# EAGLE design SP_Inverter_SW (EAGLE 9.6.2)
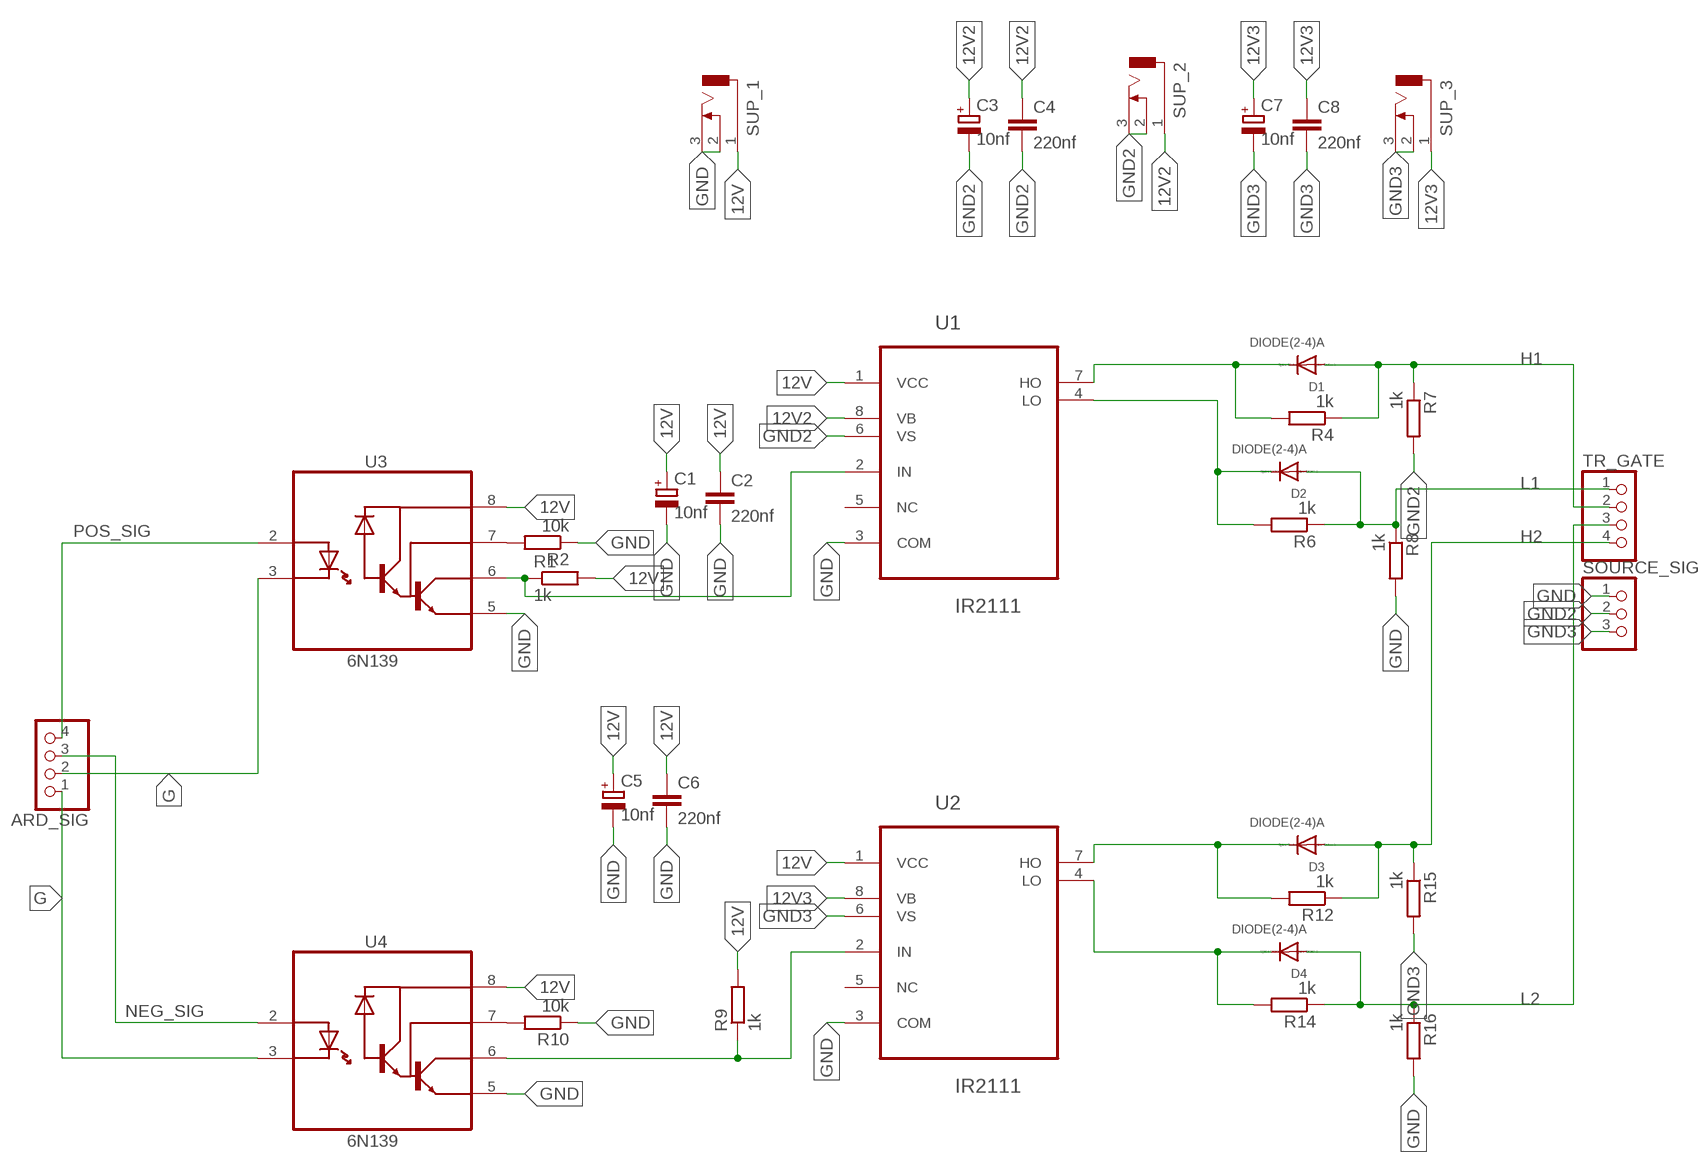
[diagram p0: schematic, sheet 1]

## Parts
ARD_SIG  PINHD-1X4  [1X04]
C1  10nf  CAP_POL  [E3,5-8]
C2  220nf  CAPACITOR  [C025-025X050]
C3  10nf  CAP_POL  [E3,5-8]
C4  220nf  CAPACITOR  [C025-025X050]
C5  10nf  CAP_POL  [E3,5-8]
C6  220nf  CAPACITOR  [C025-025X050]
C7  10nf  CAP_POL  [E3,5-8]
C8  220nf  CAPACITOR  [C025-025X050]
D1  DIODE(2-4)A  [DO35-10]
D2  DIODE(2-4)A  [DO35-10]
D3  DIODE(2-4)A  [DO35-10]
D4  DIODE(2-4)A  [DO35-10]
R1  1k  R-EU_0204/7  [0204/7]
R2  10k  R-EU_0204/7  [0204/7]
R4  1k  R-EU_0204/7  [0204/7]
R6  1k  R-EU_0204/7  [0204/7]
R7  1k  R-EU_0204/7  [0204/7]
R8  1k  R-EU_0204/7  [0204/7]
R9  1k  R-EU_0204/7  [0204/7]
R10  10k  R-EU_0204/7  [0204/7]
R12  1k  R-EU_0204/7  [0204/7]
R14  1k  R-EU_0204/7  [0204/7]
R15  1k  R-EU_0204/7  [0204/7]
R16  1k  R-EU_0204/7  [0204/7]
SOURCE_SIG  source_Sig  PINHD-1X3  [1X03]
SUP_1  CON_JACK  [DCJ0303]
SUP_2  CON_JACK  [DCJ0303]
SUP_3  CON_JACK  [DCJ0303]
TR_GATE  PINHD-1X4  [1X04]
U1  IR2111  [DIP254P762X533-8]
U2  IR2111  [DIP254P762X533-8]
U3  6N139  [DIP762W50P254L977H451Q8]
U4  6N139  [DIP762W50P254L977H451Q8]

## Nets
12V: C1.+ C2.1 C5.+ C6.1 R1.2 R9.2 SUP_1.1 U1.1(VCC) U2.1(VCC) U3.8(VCC) U4.8(VCC)
12V2: C3.+ C4.1 SUP_2.1 U1.8(VB)
12V3: C7.+ C8.1 SUP_3.1 U2.8(VB)
G: ARD_SIG.1 ARD_SIG.2 U3.3(C) U4.3(C)
GND: C1.- C2.2 C5.- C6.2 R2.1 R8.2 R10.1 R16.2 SOURCE_SIG.1 SUP_1.2 SUP_1.3 U1.3(COM) U2.3(COM) U3.5(GND) U4.5(GND)
GND2: C3.- C4.2 R7.2 SOURCE_SIG.2 SUP_2.2 SUP_2.3 U1.6(VS)
GND3: C7.- C8.2 R15.2 SOURCE_SIG.3 SUP_3.2 SUP_3.3 U2.6(VS)
H1: D1.A R4.1 R7.1 TR_GATE.2
H2: D3.A R12.1 R15.1 TR_GATE.4
L1: D2.A R6.1 R8.1 TR_GATE.1
L2: D4.A R14.1 R16.1 TR_GATE.3
N$2: D1.C R4.2 U1.7(HO)
N$3: D2.C R6.2 U1.4(LO)
N$5: R9.1 U2.2(IN) U4.6(VO)
N$8: D3.C R12.2 U2.7(HO)
N$9: R2.2 U3.7(VB)
N$11: R1.1 U1.2(IN) U3.6(VO)
N$14: R10.2 U4.7(VB)
N$20: D4.C R14.2 U2.4(LO)
NEG_SIG: ARD_SIG.3 U4.2(A)
POS_SIG: ARD_SIG.4 U3.2(A)
Unconnected: U1.5(NC) U2.5(NC)

## Library data of the parts
ARD_SIG TR_GATE = pinhead:PINHD-1X4: PIN HEADER
C1 C3 C5 C7 = MIA_LIBRARY-2-2-2:CAP_POL
C2 C4 C6 C8 = MIA_LIBRARY-2-2-2:CAPACITOR
D1-D4 = MIA_LIBRARY-2-2-2:DIODE(2-4)A: DIODE high speed (Philips)
R1 R2 R4 R6-R10 R12 R14-R16 = rcl:R-EU_: RESISTOR, European symbol; SPICEPREFIX: R
SOURCE_SIG = MIA_LIBRARY-2-2-2:PINHD-1X3: PIN HEADER
SUP_1-SUP_3 = MIA_LIBRARY-2-2-2:CON_JACK: DC POWER JACK Source: DCJ0303.pdf; OC_FARNELL: unknown; OC_NEWARK: unknown
U1 U2 = MIA_LIBRARY-2-2-2:IR2111: HALF BRIDGE DRIVER Check prices <https://pricing.snapeda.com/parts/IR2111/Infineon/view-part?ref=eda>; AVAILABILITY: In Stock; DESCRIPTION: Half-Bridge Gate Driver IC Non-Inverting 8-PDIP; MF: Infineon; MP: IR2111; PACKAGE: DIP-8 International Rectifier; PRICE: None; PURCHASE-URL: https://pricing.snapeda.com/search/part/IR2111/?ref=eda
U3 U4 = MIA_LIBRARY-2-2-2:6N139: High Speed Optocoupler, 100 kBd, Low Input Current, Photodiode Darlington Output Check prices <https://pricing.snapeda.com/parts/6N139/Vishay%20Semiconductor/view-part?ref=eda>; AVAILABILITY: In Stock; DESCRIPTION: Optoisolator Darlington with Base Output 5300Vrms 1 Channel 8-DIP; MF: Vishay Semiconductor; MP: 6N139; PACKAGE: DIP-8 Everlight; PRICE: None; PURCHASE-URL: https://pricing.snapeda.com/search/part/6N139/?ref=eda

## Board
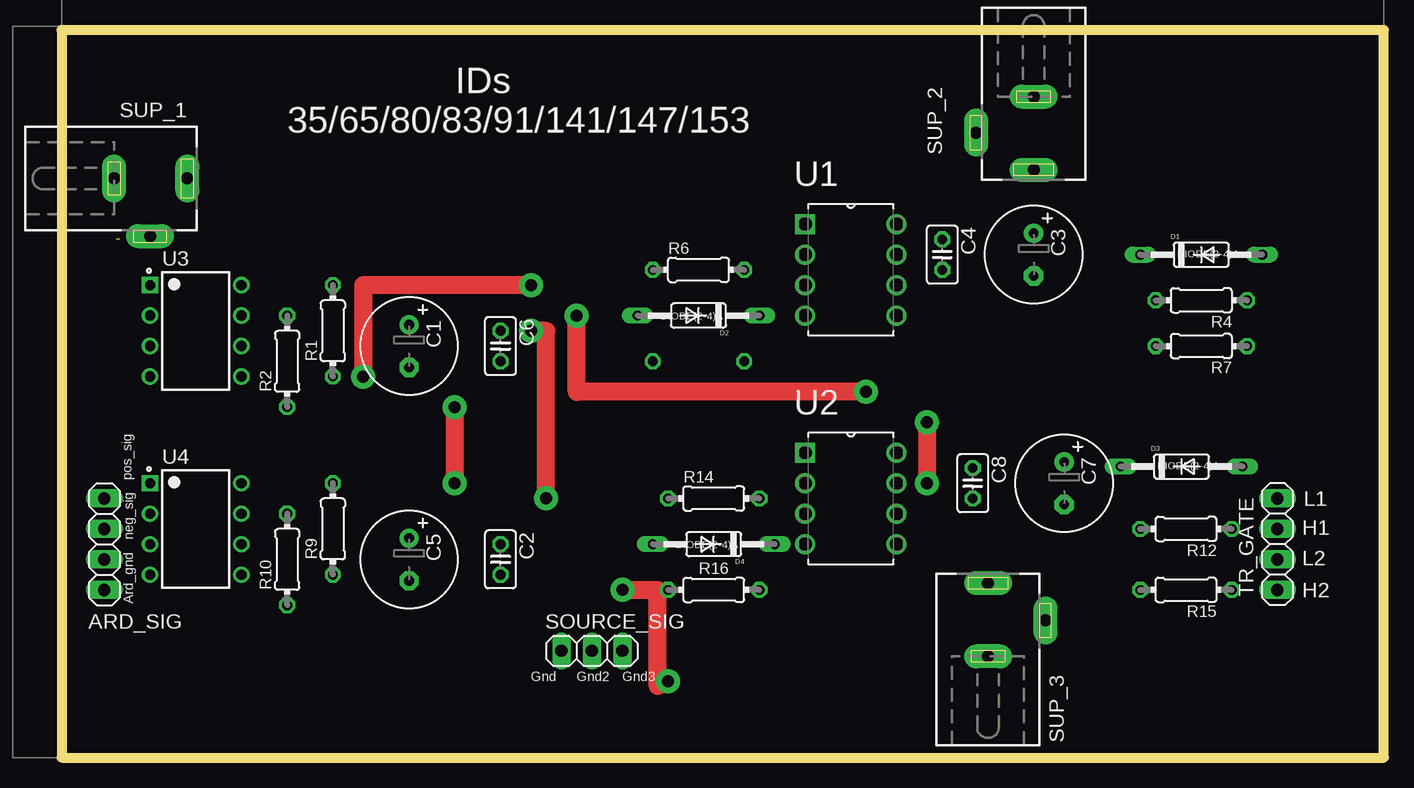
[diagram p1: board, top side]
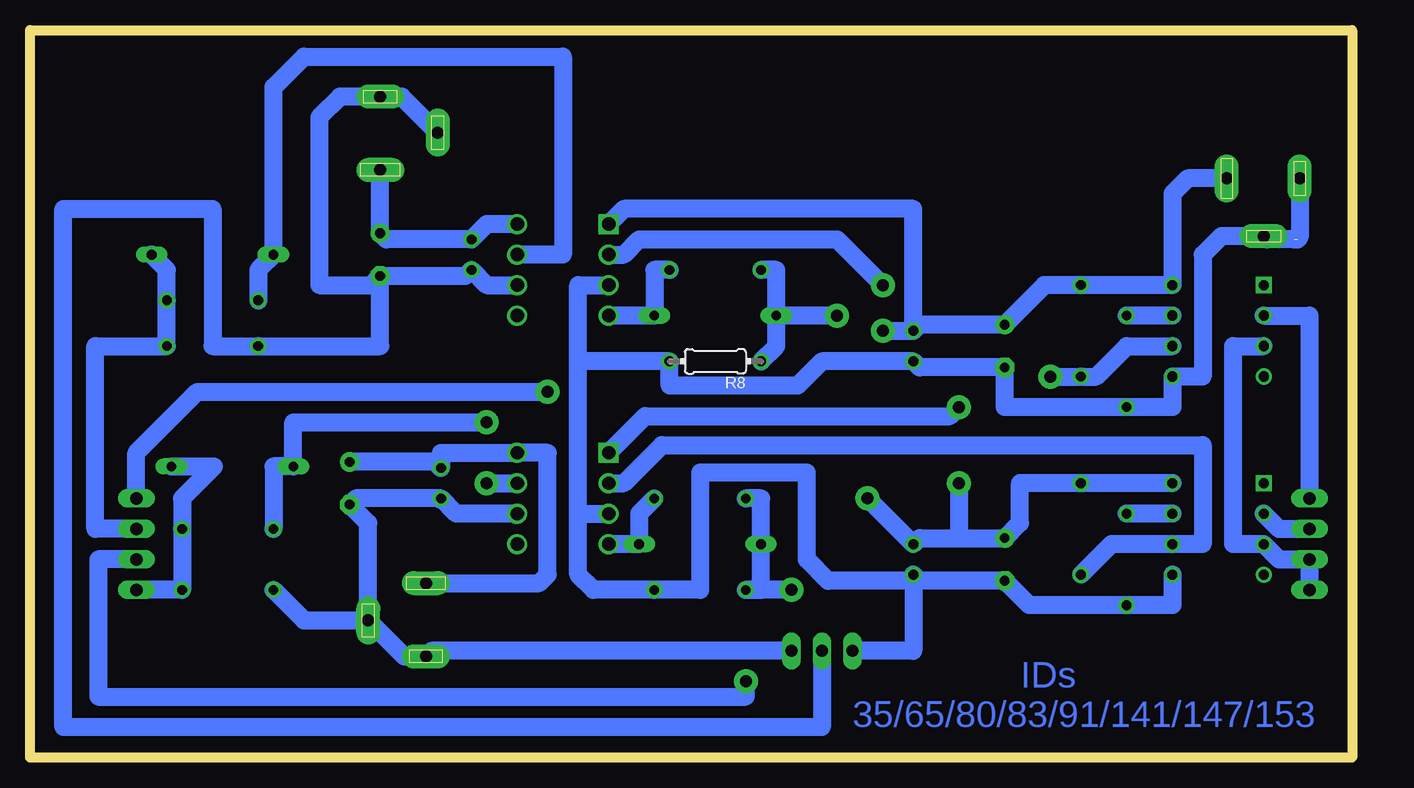
[diagram p2: board, bottom side, seen from below]

Size 110.22 x 60.63 mm. Coordinates in mm from the lower left corner, seen from the top.
Outline: 0,0 110.22,0 110.22,60.63 0,60.63 0,0
Copper layers (1*16): Top 0.035mm / dielectric 1.5mm / Bottom 0.035mm
Design rules "default": minimum track width 6mil, minimum drill 0.35mm, track to track 6mil, track to pad 6mil, pad to pad 6mil, via to via 6mil, smd to smd 6mil, copper to edge 40mil, drill to drill 6mil, minimum pad ring 10mil, minimum via ring 8mil, stop-mask expansion 4mil, vias tented up to drill 0mil, thermal gap 10mil

### Footprints (pad centres in the part's own frame; a part is rotated, then mirrored left to right if it is on the bottom)
1X04 = drill 1.016 long: 1 -3.81,0; 2 -1.27,0; 3 1.27,0; 4 3.81,0
E3,5-8 = drill 0.813 pad 1.6: + -1.778,0 | drill 0.813 pad 1.6 octagon: - 1.778,0
C025-025X050 = drill 0.813 octagon: 1 -1.27,0; 2 1.27,0
DO35-10 = drill 0.813 long: A 5.08,0; C -5.08,0
0204/7 = drill 0.813 octagon: 1 -3.81,0; 2 3.81,0
1X03 = drill 1.016 long: 1 -2.54,0; 2 0,0; 3 2.54,0
DCJ0303 = drill 1 pad 2 long: 1 0,3.1; 2 4.8,0; 3 0,-3
DIP254P762X533-8 = drill 1.118 square: 1 -7.62,7.62 | drill 1.118: 2 -7.62,5.08; 3 -7.62,2.54; 4 -7.62,0; 5 0,0; 6 0,2.54; 7 0,5.08; 8 0,7.62
DIP762W50P254L977H451Q8 = drill 0.85 pad 1.35 square: 1 -3.81,3.81 | drill 0.85 pad 1.35: 2 -3.81,1.27; 3 -3.81,-1.27; 4 -3.81,-3.81; 5 3.81,-3.81; 6 3.81,-1.27; 7 3.81,1.27; 8 3.81,3.81

### Placement (x,y rotation side)
ARD_SIG  3.56,17.78 90 top
C1  28.96,34.29 270 top
C2  36.58,16.51 270 top
C3  81.03,41.91 270 top
C4  73.41,41.91 270 top
C5  28.96,16.51 270 top
C6  36.58,34.29 270 top
C7  83.57,22.86 270 top
C8  75.95,22.86 270 top
D1  95,41.91 0 top
D2  53.09,36.83 180 top
D3  93.34,24.26 0 top
D4  54.36,17.78 180 top
R1  22.61,35.56 90 top
R2  18.8,33.02 90 top
R4  95,38.1 180 top
R6  53.09,40.64 0 top
R7  95,34.29 180 top
R8  53.09,33.02 180 bottom
R9  22.61,19.05 90 top
R10  18.8,16.51 90 top
R12  93.73,19.05 180 top
R14  54.36,21.59 0 top
R15  93.73,13.97 180 top
R16  54.36,13.97 0 top
SOURCE_SIG  44.2,8.89 0 top
SUP_1  7.37,48.26 270 top
SUP_2  81.03,52.07 180 top
SUP_3  77.22,11.43 0 top
TR_GATE  101.35,17.78 270 top
U1  69.6,36.83 0 top
U2  69.6,17.78 0 top
U3  11.18,35.56 0 top
U4  11.18,19.05 0 top

### Tracks (layer width: path | path; a pad name or v marks a point on that pad's centre or on a via)
12V  (via drill 1 pad 2)
  Top 1.5: v40.39,21.59 40.39,35.56 v39.12,35.56 | v32.77,29.21 v32.77,22.86
  Bottom 1.5: SUP_1.1 13.72,48.26 14.99,46.99 U3.8 R1.2 25.65,39.37 C1.+ 36.07,36.07 C6.1 | C6.1 36.58,45.72 60.71,45.72 U1.1 | U4.8 R9.2 27.69,22.86 27.69,19.56 C5.+ 32.77,18.29 | 32.77,18.29 36.07,18.29 C2.1 v40.39,21.59 | v39.12,35.56 C6.1 | U2.1 58.93,28.45 33.53,28.45 v32.77,29.21 | v32.77,22.86 32.77,18.29
12V2
  Bottom 1.5: SUP_2.1 C3.+ 80.52,43.18 C4.1 72.14,44.45 U1.8
12V3
  Bottom 1.5: C7.+ 76.45,24.64 C8.1 75.95,25.4 U2.8 67.06,25.4 67.06,15.24 67.77,14.53 SUP_3.1
G
  Bottom 1.5: ARD_SIG.1 ARD_SIG.2 6.1,16.51 U4.3 9.91,17.78 9.91,34.29 U3.3
GND  (1 unrouted)
  Bottom 1.5: SUP_1.3 4.37,43.36 4.55,43.18 | 4.83,43.18 7.09,43.18 SUP_1.2 10.9,43.46 12.45,41.91 12.45,31.75 U3.5 14.99,29.21 R2.1 28.96,29.21 C1.- 36.07,32.51 C6.2 44.2,33.02 46.23,30.99 56.9,30.99 R8.2 64.52,33.02 | 64.52,33.02 64.52,39.37 U1.3 | U4.5 14.99,12.7 R10.1 26.92,12.7 C5.- 36.07,14.73 | 36.07,14.73 C2.2 36.58,8.89 SOURCE_SIG.1 | 64.52,20.32 64.52,15.24 63.25,13.97 R16.2 54.36,13.97 54.36,23.75 45.47,23.75 45.47,16.51 43.69,14.73 36.07,14.73 | 64.52,20.32 U2.3 | 64.52,20.32 64.52,33.02
GND2
  Bottom 1.5: C3.- 81.03,34.29 R7.2 95,34.29 95,45.72 107.44,45.72 107.44,2.54 44.2,2.54 SOURCE_SIG.2 | SUP_2.2 79.23,55.07 SUP_2.3 84.38,55.07 86.11,53.34 86.11,39.37 81.79,39.37 C3.- | C3.- 73.91,40.13 C4.2 72.14,39.37 U1.6
GND3
  Bottom 1.5: SOURCE_SIG.3 76.76,8.89 SUP_3.3 79.02,8.43 SUP_3.2 | SUP_3.2 82.02,19.53 C7.- 83.06,21.59 C8.2 | 69.72,20.19 U2.6 74.68,20.32 C8.2 | C8.2 75.95,21.46 | R15.2 87.38,11.43 SUP_3.2
H1
  Bottom 1.5: D1.A 98.81,40.64 R4.1 R7.1 104.77,34.29 104.77,19.05 TR_GATE.2
H2
  Bottom 1.5: D3.A 94.87,24.26 97.54,21.59 R12.1 R15.1 TR_GATE.4
L1  (via drill 1 pad 2)
  Top 1.5: v67.06,30.48 42.93,30.48 v42.93,36.83
  Bottom 1.5: R8.1 48.01,34.29 D2.A | D2.A 48.01,40.64 R6.1 | TR_GATE.1 101.35,25.4 96.27,30.48 v67.06,30.48 | v42.93,36.83 D2.A
L2  (via drill 1 pad 2)
  Top 1.5: v50.55,6.35 50.07,6.35 49.67,5.96 49.67,13.97 v46.74,13.97
  Bottom 1.5: R14.1 49.28,21.59 D4.A 49.28,13.97 R16.1 v46.74,13.97 | TR_GATE.3 104.52,16.51 104.52,5.08 50.55,5.08 v50.55,6.35
N$2
  Bottom 1.5: R4.2 91.19,40.64 D1.C 89.92,55.88 87.38,58.42 65.79,58.42 65.79,41.91 U1.7
N$3
  Bottom 1.5: R6.2 58.17,40.64 D2.C U1.4
N$5
  Bottom 1.5: R9.1 20.07,17.78 U4.6 12.45,17.78 12.45,26.04 57.53,26.04 60.71,22.86 U2.2
N$8  (via drill 1 pad 2)
  Top 1.5: v72.14,27.94 v72.14,22.86
  Bottom 1.5: R12.2 89.92,24.26 D3.C 88.27,27.94 v72.14,27.94 | v72.14,22.86 U2.7
N$9
  Bottom 1.5: U3.7 R2.2
N$11  (via drill 1 pad 2)
  Top 1.5: v39.12,39.37 25.15,39.37 v25.15,31.75
  Bottom 1.5: U3.6 18.8,34.29 21.34,31.75 R1.1 v25.15,31.75 | U1.2 60.71,41.91 59.44,43.18 42.93,43.18 v39.12,39.37
N$14
  Bottom 1.5: U4.7 R10.2
N$20
  Bottom 1.5: R14.2 59.44,20.32 D4.C U2.4
NEG_SIG
  Bottom 1.5: U4.2 6.1,19.05 ARD_SIG.3
POS_SIG
  Bottom 1.5: U3.2 3.56,36.83 ARD_SIG.4

### Text on the board
Bottom: IDs / 35/65/80/83/91/141/147/153
tPlace: IDs / 35/65/80/83/91/141/147/153 | pos_sig | L1 | H1 | neg_sig | L2 | Ard_gnd | H2 | Gnd | Gnd2 | Gnd3